# EAGLE design MatrixShieldV1 (EAGLE 6.4)
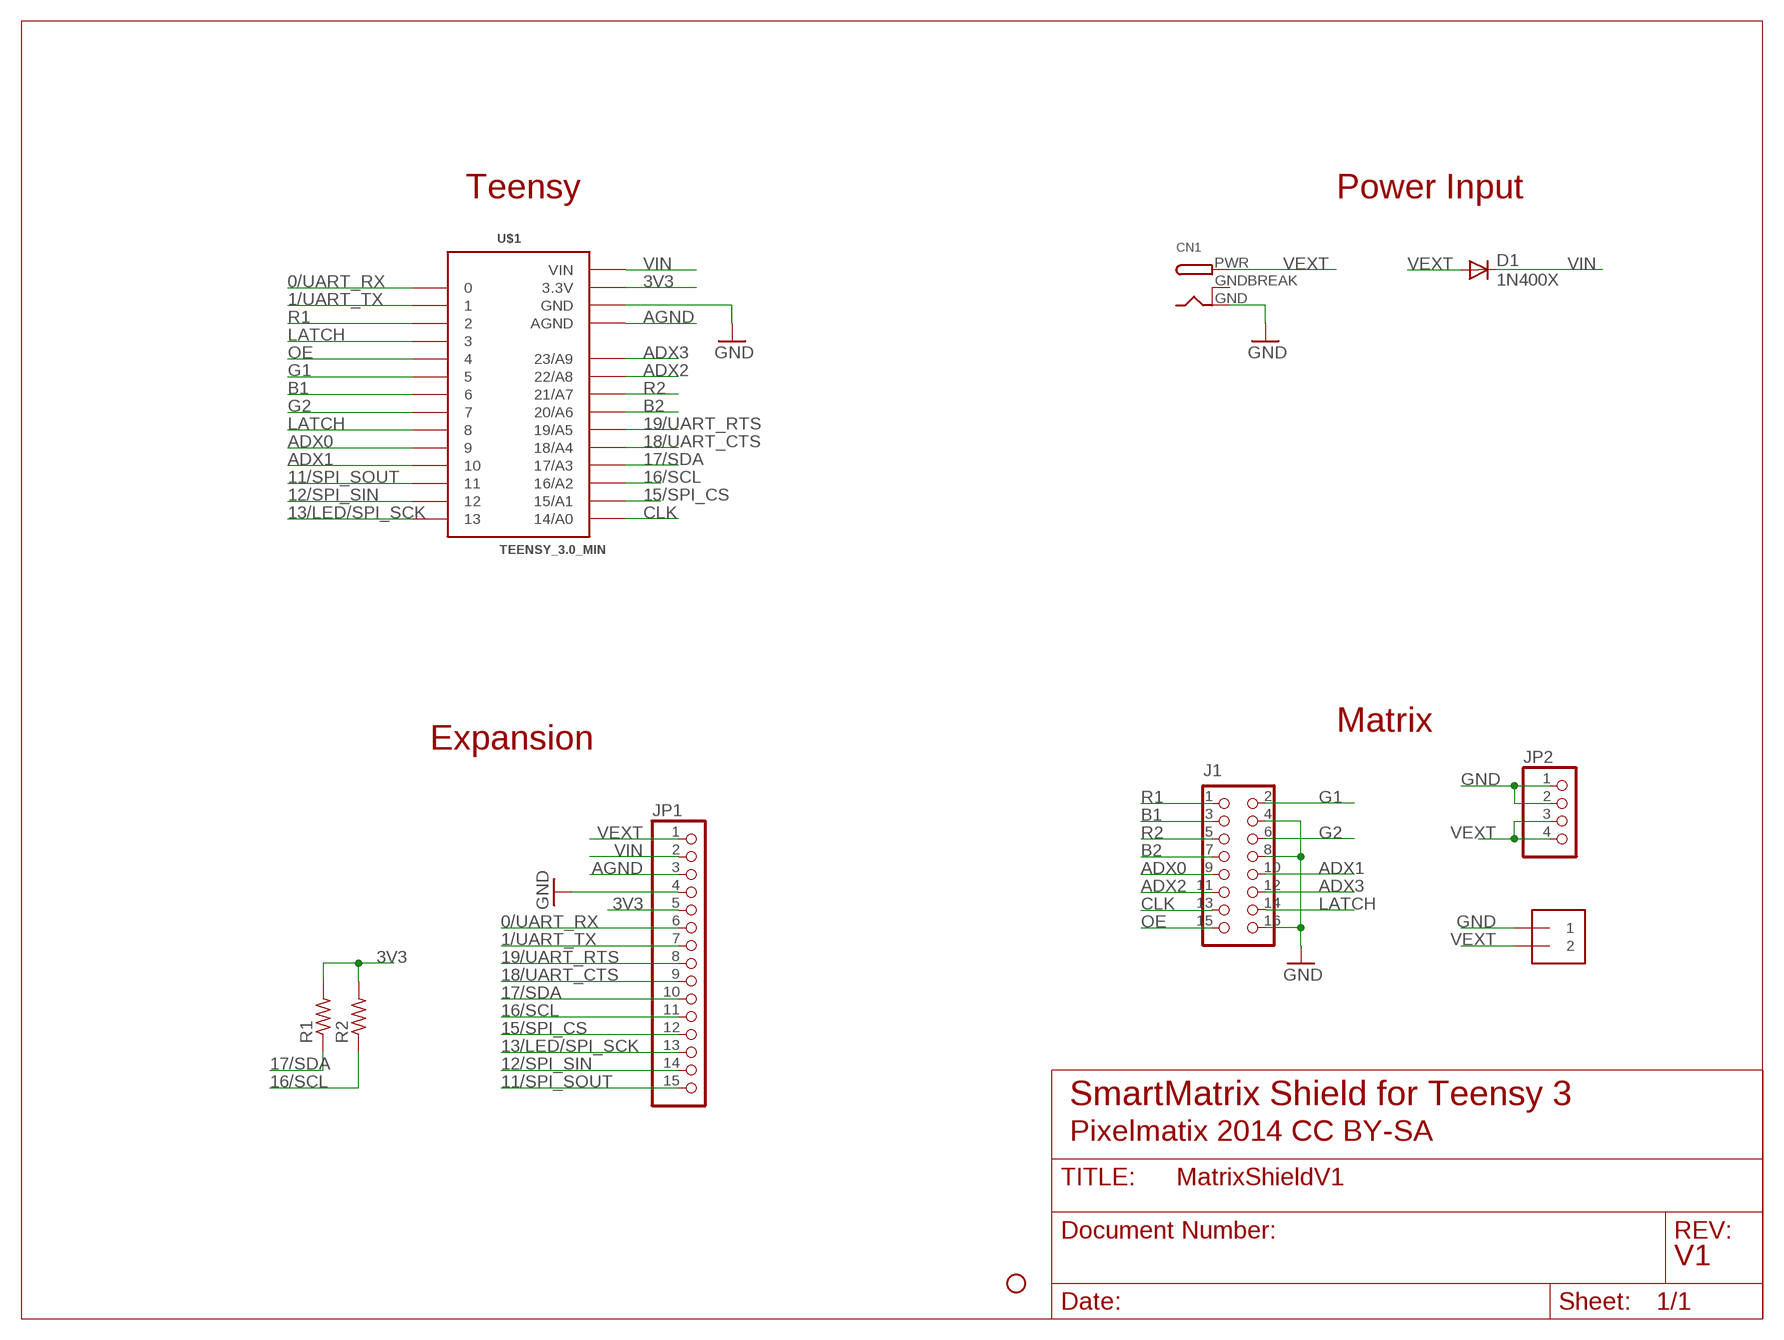
[diagram p0: schematic, sheet 1]

## Parts
CN1  DCBARRELPTH  [DCJACK_2MM_PTH]
D1  1N400X  [DIODE-TH-0.3"]
J1  CON_HEADER_2X08-PTH-SHROUDED  [PINSHRD_PTH_2X08]
J4  1X2-5.0  [1X2-5.0MM]
JP1  PINHD-1X15_2.54-S  [1X15-S]
JP2  PINHD-1X04_1.56  [1X04-1.56"]
JP5  STAND-OFFSTAND-OFF-3MM  [STAND-OFF-3MM]
R1  R-US_0207/7  [0207/7]
R2  R-US_0207/7  [0207/7]
U$1  TEENSY_3.0_MIN  [TEENSY_3.0_MIN]

## Nets
0/UART_RX: JP1.6 U$1.0
1/UART_TX: JP1.7 U$1.1
3V3 [power]: JP1.5 R1.2 R2.2 U$1.3.3V
11/SPI_SOUT: JP1.15 U$1.11
12/SPI_SIN: JP1.14 U$1.12
13/LED/SPI_SCK: JP1.13 U$1.13
15/SPI_CS: JP1.12 U$1.15/A1
16/SCL: JP1.11 R2.1 U$1.16/A2
17/SDA: JP1.10 R1.1 U$1.17/A3
18/UART_CTS: JP1.9 U$1.18/A4
19/UART_RTS: JP1.8 U$1.19/A5
ADX0: J1.9 U$1.9
ADX1: J1.10 U$1.10
ADX2: J1.11 U$1.22/A8
ADX3: J1.12 U$1.23/A9
AGND [power]: JP1.3 U$1.AGND
B1: J1.3 U$1.6
B2: J1.7 U$1.20/A6
CLK: J1.13 U$1.14/A0
G1: J1.2 U$1.5
G2: J1.6 U$1.7
GND [power]: CN1.GND J1.4 J1.8 J1.16 J4.1 JP1.4 JP2.1 JP2.2 U$1.GND
LATCH: J1.14 U$1.3 U$1.8
OE: J1.15 U$1.4
R1: J1.1 U$1.2
R2: J1.5 U$1.21/A7
VEXT [power]: CN1.PWR D1.A J4.2 JP1.1 JP2.3 JP2.4
VIN [power]: D1.C JP1.2 U$1.VIN

## Notes on the sheet
- Teensy | Power Input
- Matrix
- Expansion
- SmartMatrix Shield for Teensy 3
- Pixelmatix 2014 CC BY-SA
- V1

## Power pins joined to a net without a drawn wire
GNDBREAK: CN1.GNDBREAK

## Library data of the parts
CN1 = adafruit:DCBARREL: 2.0mm DC Barrel Jack DCJACK_2MM_PTH - Through Hole Jack (4UConnector: 05537)
D1 = eclibrary:1N400X
J1 = eclibrary:CON_HEADER_2X08: 2x07 pin header
J4 = eclibrary:1X2: 3.5mm Terminal block - matches dimensions of 4Uconnector part# 19974 from http://www.ladyada.net/library/pcb/eaglelibrary.html 5.0mm Terminal block - matches dimensions of 4Uconnector part# 20182
JP1 = pinhead-2:PINHD-1X15: PIN HEADER
JP2 = eclibrary:PINHD-1X04: PIN HEADER
JP5 = eclibrary:STAND-OFF: Stand Off STAND-OFF-2.5MM is Using dimensions for 4.5mm diameter Hex Standoff (2.598mm keepout radius = outer radius of standoff) STAND-OFF-3MM is Using dimensions for a 6mm diameter Hex screw (3mm keepout radius), assuming a smaller 4.5mm diameter hex standoff is used Other parts are from sparkfun sample
R1 R2 = rcl:R-US_: RESISTOR, American symbol
U$1 = eclibrary:TEENSY_3.0_MIN: Basic Teensy 3.0 with none of the 'inner' pins enabled. See '+4', 'AllAnalogPins", and 'AllPins' packages for additional pin holes, as needed.

## Net classes
0 default: width 0.254 mm
1 power: width 0.406 mm

## Board
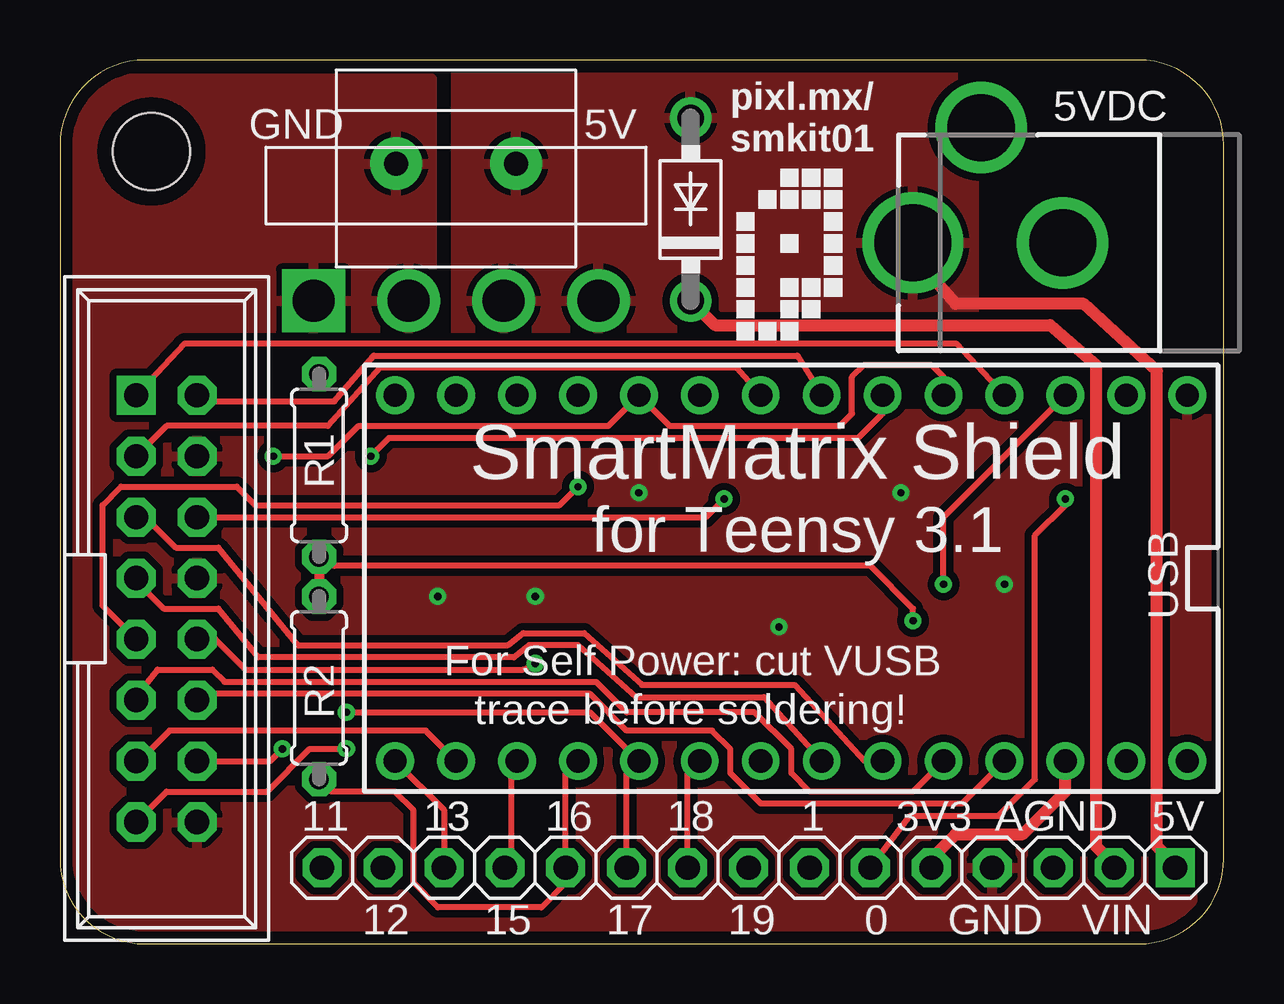
[diagram p1: board, top side]
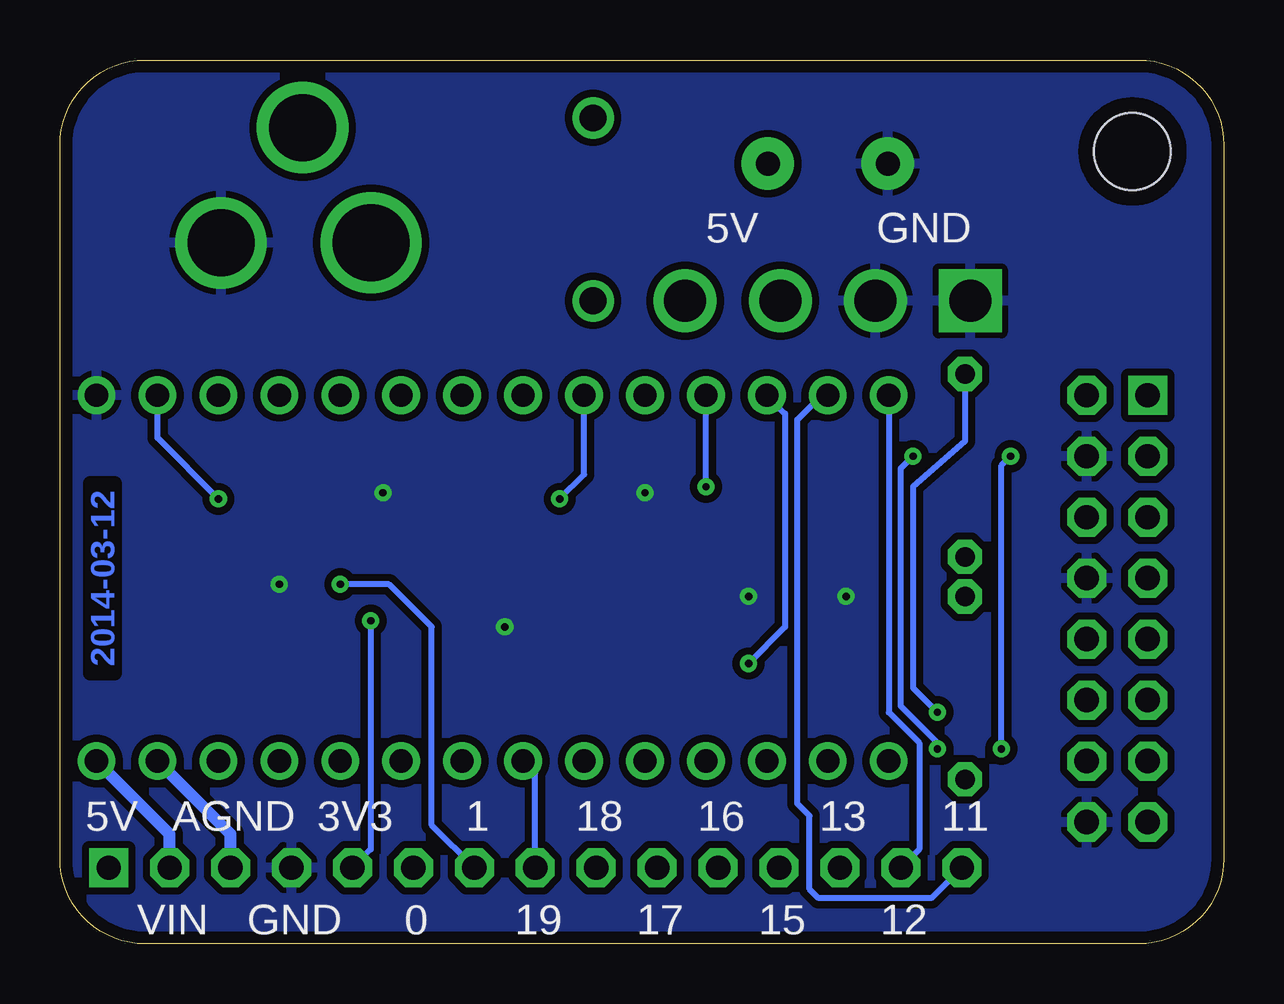
[diagram p2: board, bottom side, seen from below]

Size 48.51 x 36.83 mm. Coordinates in mm from the lower left corner, seen from the top.
Outline: 48.51,3.56 48.51,33.27 arc90 44.96,36.83 3.56,36.83 arc90 0,33.27 0,3.56 arc90 3.56,0 44.96,0 arc90 48.51,3.56
Copper layers (1*16): Top 0.035mm / dielectric 1.5mm / Bottom 0.035mm
Design rules "EagleRulesSmartProto100201 *": minimum track width 8mil, minimum drill 12mil, track to track 9mil, track to pad 9mil, pad to pad 9mil, via to via 9mil, smd to smd 0mil, copper to edge 20mil, drill to drill 10mil, minimum pad ring 12mil, minimum via ring 8mil, stop-mask expansion 2mil, vias tented up to drill 100mil, thermal gap 10mil

### Footprints (pad centres in the part's own frame; a part is rotated, then mirrored left to right if it is on the bottom)
DCJACK_2MM_PTH = drill 2.8: GND 0,7.35; GNDBREAK 4.8,10.75 | drill 3.2: PWR 0,13.6
DIODE-TH-0.3" = drill 1.118: A 3.81,0; C -3.81,0
PINSHRD_PTH_2X08 = drill 1.016 square: 1 -8.89,-1.27 | drill 1.016 octagon: 2 -8.89,1.27; 3 -6.35,-1.27; 4 -6.35,1.27; 5 -3.81,-1.27; 6 -3.81,1.27; 7 -1.27,-1.27; 8 -1.27,1.27; 9 1.27,-1.27; 10 1.27,1.27; 11 3.81,-1.27; 12 3.81,1.27; 13 6.35,-1.27; 14 6.35,1.27; 15 8.89,-1.27; 16 8.89,1.27
1X2-5.0MM = drill 1 pad 2.184: 1 2.5,0; 2 -2.5,0
1X15-S = drill 1.016 square: 1 -17.78,0 | drill 1.016 octagon: 2 -15.24,0; 3 -12.7,0; 4 -10.16,0; 5 -7.62,0; 6 -5.08,0; 7 -2.54,0; 8 0,0; 9 2.54,0; 10 5.08,0; 11 7.62,0; 12 10.16,0; 13 12.7,0; 14 15.24,0; 15 17.78,0
1X04-1.56" = drill 1.75 square: 1 -5.944,0 | drill 1.75: 2 -1.981,0; 3 1.981,0; 4 5.944,0
STAND-OFF-3MM = hole 3.2: 0,0
0207/7 = drill 0.813 octagon: 1 -3.81,0; 2 3.81,0
TEENSY_3.0_MIN = drill 0.965: 0 -7.62,13.97; 1 -7.62,11.43; 2 -7.62,8.89; 3 -7.62,6.35; 3.3V 7.62,11.43; 4 -7.62,3.81; 5 -7.62,1.27; 6 -7.62,-1.27; 7 -7.62,-3.81; 8 -7.62,-6.35; 9 -7.62,-8.89; 10 -7.62,-11.43; 11 -7.62,-13.97; 12 -7.62,-16.51; 13 7.62,-16.51; 14/A0 7.62,-13.97; 15/A1 7.62,-11.43; 16/A2 7.62,-8.89; 17/A3 7.62,-6.35; 18/A4 7.62,-3.81; 19/A5 7.62,-1.27; 20/A6 7.62,1.27; 21/A7 7.62,3.81; 22/A8 7.62,6.35; 23/A9 7.62,8.89; AGND 7.62,13.97; GND -7.62,16.51; VIN 7.62,16.51

### Placement (x,y rotation side)
CN1  49.15,29.21 90 top
D1  26.29,30.61 90 top
J1  4.45,13.97 270 top
J4  16.51,32.51 180 top
JP1  28.7,3.17 180 top
JP2  16.51,26.8 0 top
JP5  3.81,33.02 0 top
R1  10.79,19.94 270 top
R2  10.79,10.67 90 top
U$1  30.48,15.24 270 top
U$4  [PIXELMATIX-LOGO-300]  28.19,25.15 0 top

### Tracks (layer width: path | path; a pad name or v marks a point on that pad's centre or on a via)
0/UART_RX  (via drill 0.3)
  Top 0.254: JP1.6 35.43,5.33 39.12,5.33 40.64,6.86 40.64,17.02 41.91,18.29 v41.91,18.54
  Bottom 0.254: v41.91,18.54 44.45,21.08 U$1.0
1/UART_TX  (via drill 0.3)
  Top 0.254: v36.83,14.99 36.83,17.78 U$1.1
  Bottom 0.254: JP1.7 33.02,4.95 33.02,13.21 34.8,14.99 v36.83,14.99
3V3  (via drill 0.3)
  Top 0.254: R1.2 11.05,16.13 11.43,15.75 33.78,15.75 35.56,13.97 v35.56,13.46
  Top 0.406: R1.2 R2.2
  Top 0.508: JP1.5 36.32,3.56 37.34,4.57 40.13,4.57 41.91,6.35 U$1.3.3V
  Bottom 0.254: v35.56,13.46 35.56,3.94 JP1.5
11/SPI_SOUT
  Bottom 0.254: JP1.15 12.19,1.91 16.89,1.91 17.27,2.29 17.27,5.33 17.78,5.84 17.78,21.84 16.76,22.86 U$1.11
12/SPI_SIN
  Bottom 0.254: U$1.12 13.97,9.65 12.7,8.38 12.7,3.94 JP1.14
13/LED/SPI_SCK
  Top 0.254: U$1.13 16,5.59 JP1.13
15/SPI_CS
  Top 0.254: JP1.12 18.8,3.43 18.8,7.37 U$1.15/A1
16/SCL
  Top 0.254: U$1.16/A2 21.08,7.11 JP1.11 21.08,2.54 20.07,1.52 15.75,1.52 14.73,2.54 14.73,5.59 13.97,6.35 11.3,6.35 R2.1
17/SDA  (via drill 0.3)
  Top 0.254: JP1.10 23.62,7.11 U$1.17/A3 22.1,9.65 v11.94,9.65
  Bottom 0.254: R1.1 10.79,20.95 12.95,19.05 12.95,10.67 v11.94,9.65
18/UART_CTS
  Top 0.254: JP1.9 26.16,7.11 U$1.18/A4
19/UART_RTS
  Bottom 0.254: JP1.8 28.7,7.11 U$1.19/A5
ADX0  (via drill 0.3)
  Top 0.254: J1.9 1.78,14.1 1.78,18.29 2.54,19.05 7.37,19.05 8.13,18.29 20.83,18.29 v21.59,19.05
  Bottom 0.254: v21.59,19.05 U$1.9
ADX1  (via drill 0.3)
  Top 0.254: v19.81,11.68 19.3,11.43 7.75,11.43 6.48,12.7 J1.10
  Bottom 0.254: U$1.10 18.29,22.1 18.29,13.21 v19.81,11.68
ADX2
  Top 0.254: U$1.22/A8 35.56,6.35 31.24,6.35 30.48,7.11 30.48,8.13 28.96,9.65 23.62,9.65 22.35,10.92 6.86,10.92 6.35,11.43 4.06,11.43 3.05,10.16 J1.11
ADX3
  Top 0.254: U$1.23/A9 37.59,5.84 29.21,5.84 27.94,7.11 27.94,8.13 27.18,8.89 23.62,8.89 22.1,10.41 6.48,10.41 J1.12
AGND
  Bottom 0.508: JP1.3 41.4,4.57 U$1.AGND
B1
  Top 0.254: U$1.6 28.19,24 13.34,24 11.18,21.59 4.45,21.59 J1.3
B2
  Top 0.254: U$1.20/A6 29.34,10.29 24,10.29 21.59,12.45 19.56,12.45 18.92,11.94 8.26,11.94 6.6,13.97 4.32,13.97 3.17,15.11 J1.7
CLK
  Top 0.254: U$1.14/A0 15.24,8.89 4.57,8.89 3.3,7.62 J1.13
G1
  Top 0.254: J1.2 5.97,22.61 11.43,22.61 13.08,24.51 30.73,24.51 U$1.5
G2  (via drill 0.3)
  Top 0.254: J1.6 26.92,17.78 v27.69,18.54
  Bottom 0.254: v27.69,18.54 26.67,19.56 U$1.7
GND  (via drill 0.3)
  other vias: 19.81,14.48 15.75,14.48 39.37,14.99 24.13,18.8 35.05,18.8 29.97,13.21
  pour Bottom (isolate 0.305): 48.26,36.83 0,36.83 0,0 48.26,0
  pour Top (isolate 0.305, rank 2): 0,36.07 15.49,36.07 15.49,22.1 48.26,22.1 48.26,0 0,0
LATCH  (via drill 0.3)
  Top 0.254: J1.14 8.76,7.62 v9.27,8.13 | v8.89,20.32 11.18,20.32 12.45,21.59 22.86,21.59 U$1.8 25.4,21.59 32.51,21.59 33.02,22.1 33.02,23.62 33.53,24.13 36.32,24.13 36.83,23.62 U$1.3
  Bottom 0.254: v8.89,20.32 9.27,19.94 v9.27,8.13
OE  (via drill 0.3)
  Top 0.254: v12.95,20.32 13.72,21.08 33.27,21.08 34.29,22.1 U$1.4 | J1.15 4.45,6.35 8.64,6.35 10.41,8.13 v11.94,8.13
  Bottom 0.254: v11.94,8.13 11.94,8.38 13.46,9.91 13.46,19.81 v12.95,20.32
R1
  Top 0.254: U$1.2 37.34,25.02 5.21,25.02 J1.1
R2
  Top 0.254: J1.5 3.56,17.78 4.83,16.51 6.6,16.51 9.91,12.45 18.67,12.45 19.3,12.95 21.84,12.95 24.26,10.79 30.63,10.79 33.55,7.62 U$1.21/A7
VEXT
  Top 0.508: JP1.1 46.48,3.3 45.72,4.06 45.72,23.88 42.67,26.67 37.34,26.67 35.31,28.96 35.8,28.96 CN1.PWR
  pour Top (isolate 0.305): 16.51,36.58 38.1,36.58 38.1,23.88 16.51,23.88
VIN
  Top 0.508: D1.C 27.3,25.78 41.27,25.78 43.18,24.13 43.18,4.06 43.94,3.3 JP1.2
  Bottom 0.508: JP1.2 43.94,4.57 U$1.VIN

### Text on the board
Bottom: 2014-03-12
tPlace: GND | 5V | 5VDC | pixl.mx/ / smkit01 | SmartMatrix Shield | for Teensy 3.1 | USB | For Self Power: cut VUSB | trace before soldering! | 11 | 13 | 16 | 18 | 1 | 3V3 | AGND | 5V | 12 | 15 | 17 | 19 | 0 | GND | VIN
bPlace: GND | 5V | 11 | 13 | 16 | 18 | 1 | 3V3 | AGND | 5V | 12 | 15 | 17 | 19 | 0 | GND | VIN
Document: Rev V1 | SmartMatrix Shield for Teensy 3 | Pixelmatix 2014 CC BY-SA